# Altium schematic sheet 9DOF_Sensors.SchDoc
size A
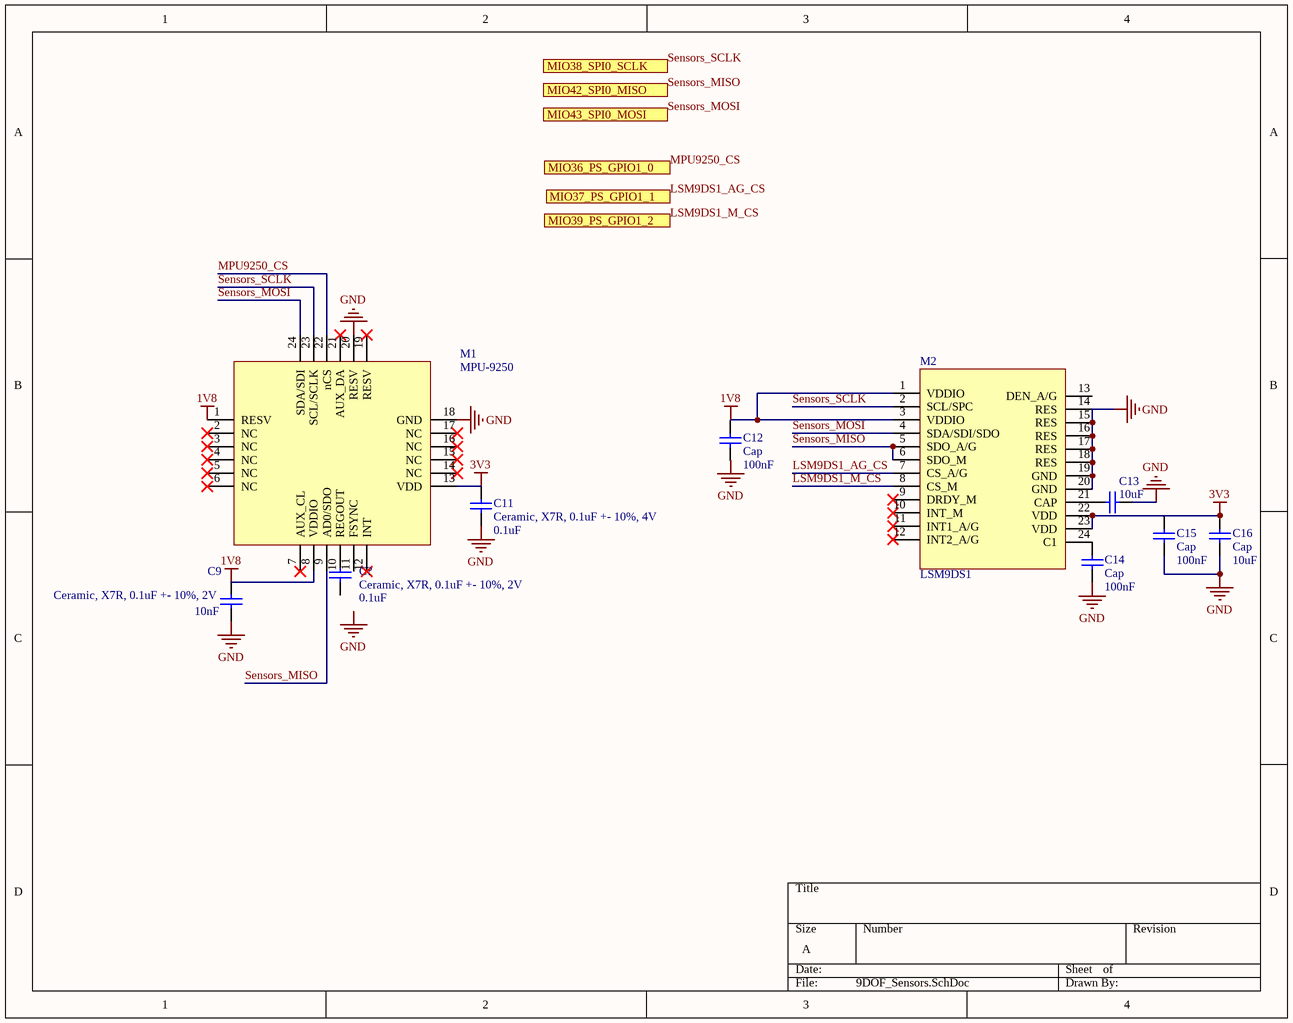
[diagram p0: 9DOF_Sensors.SchDoc]

## Parts
C9  Ceramic, X7R, 0.1uF +- 10%, 2V  value 10nF  [0402]
C11  Ceramic, X7R, 0.1uF +- 10%, 4V  value 0.1uF  [0402]
C12  Cap  value 100nF  [0402]
C13  value 10uF  [0402]  (hidden comment: Cap)
C14  Cap  value 100nF  [0402]
C15  Cap  value 100nF  [0402]
C16  Cap  value 10uF  [0402]
C?  Ceramic, X7R, 0.1uF +- 10%, 2V  value 0.1uF  [0402]
M1  MPU-9250  [MPU-9250]
M2  LSM9DS1  [LSM9DS1]

## Ports
MIO36_PS_GPIO1_0, MIO37_PS_GPIO1_1, MIO38_SPI0_SCLK, MIO39_PS_GPIO1_2, MIO42_SPI0_MISO, MIO43_SPI0_MOSI

## Nets
1V8: C12.1 M1.1(RESV) M1.8(VDDIO) M2.1(VDDIO) M2.3(VDDIO)
3V3: C11.2 C15.2 C16.2 M1.13(VDD) M2.22(VDD) M2.23(VDD)
GND: C9.1 C11.1 C12.2 C13.1 C14.1 C15.1 C16.1 M1.18(GND) M1.20(RESV) M2.14(RES) M2.15(RES) M2.16(RES) M2.17(RES) M2.18(RES) M2.19(GND) M2.20(GND)
LSM9DS1_AG_CS: M2.7(CS_A/G) ; port MIO37_PS_GPIO1_1
LSM9DS1_M_CS: M2.8(CS_M) ; port MIO39_PS_GPIO1_2
MPU9250_CS: M1.22(nCS) ; port MIO36_PS_GPIO1_0
Sensors_MISO: M1.9(AD0/SDO) M2.5(SDO_A/G) M2.6(SDO_M) ; port MIO42_SPI0_MISO
Sensors_MOSI: M1.24(SDA/SDI) M2.4(SDA/SDI/SDO) ; port MIO43_SPI0_MOSI
Sensors_SCLK: M1.23(SCL/SCLK) M2.2(SCL/SPC) ; port MIO38_SPI0_SCLK
NetC13_2: C13.2 M2.21(CAP)
NetC14_2: C14.2 M2.24(C1)

Not connected (* = marked no-connect by the designer): C9 2; C? 1 2; M1 2(NC)* 3(NC)* 4(NC)* 5(NC)* 6(NC)* 7(AUX_CL)* 10(REGOUT) 11(FSYNC) 12(INT)* 14(NC)* 15(NC)* 16(NC)* 17(NC)* 19(RESV)* 21(AUX_DA)*; M2 9(DRDY_M)* 10(INT_M)* 11(INT1_A/G)* 12(INT2_A/G)* 13(DEN_A/G)

## Notes on the sheet
- Labels drawn without touching a wire or pin: GND

## Library data of the parts
C9 C11-C16 C? = Cap: Capacitor; Published: 8-Jun-2000; LatestRevisionDate: 17-Jul-2002; LatestRevisionNote: Re-released for DXP Platform.; PackageReference: RAD-0.3; Publisher: Altium Limited; PackageDescription: Radial Cap, Thru-Hole; 2 Leads; 0.3 in Pin Spacing